# Altium schematic sheet ResetCircuit.SchDoc
size A; SheetNumber: 5; SheetTotal: 8
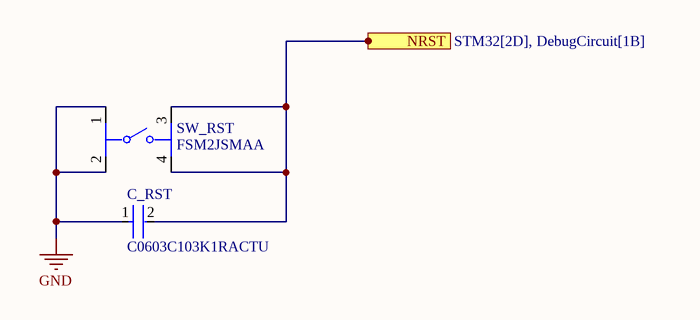
[diagram p0: ResetCircuit.SchDoc]

## Parts
C_RST  C0603C103K1RACTU  [FP-C0603C-CF-MFG]
SW_RST  FSM2JSMAA  [FP-FSM2JSMAA-MFG]

## Ports
NRST (see STM32[2D], DebugCircuit[1B])

## Nets
GND: C_RST.1 SW_RST.1 SW_RST.2
NRST: C_RST.2 SW_RST.3 SW_RST.4 ; port NRST

## Library data of the parts
C_RST = CMP-2006-03036-2: CAP CER 10000PF 100V X7R 0603; Manufacturer: KEMET; Temperature Coefficient: 30ppm/°C; Capacitance: 10,000 pF; Automotive Grade: Grade 1; Value: 10,000 pF; Tolerance: 0.1; ComponentLink2URL: https://api.kemet.com/component-edge/download/datasheet/C0603C100J5GACAUTO.pdf; Height: 0.87mm; ComponentLink2Description: Datasheet; Category: Cap; Mouser Description: Multilayer Ceramic Capacitors MLCC - SMD/SMT 100volts 10000pF X7R 10%; Device Class L3: Ceramic Capacitors; Voltage Rating: 100 V; Temperature Range High: +125°C; Octopart: https://octopart.com/c0603c103k1ractu-kemet-134140; Package: C0603C-CF; Temperature Range Low: -55°C; Device Class L1: Passive Components; Temperature: -55°C to +125°C; RoHS: TRUE; Device Class L2: Capacitors; Lead Free: Yes; Temperature Characteristic: X7R; Manufacturer Part Number: C0603C103K1RACTU; Material: Ceramic; Digikey Description: CAP CER 10000PF 100V X7R 0603; Automotive: Yes
SW_RST = CMP-03402-000003-1: SWITCH TACTILE SPST-NO 0.05A 24V; Manufacturer: TE Connectivity; Standoff Height: 0.05mm; Contact Current Rating: 50mA; Electromechanical Life: 100000Cycles; Operating Force: 260gf; Contact Resistance: 100mΩ; Package: 0; Temperature Range High: +85°C; Temperature: -35°C to +85°C; Category: Switch; Manufacturer Part Number: FSM2JSMAA; RoHS: TRUE; Mouser Description: Tactile Switches TACTILE 260G FORCE S; Device Class L1: Electromechanical; Mount: Surface Mount; Height: 4.59mm; ComponentLink2URL: https://www.te.com/commerce/DocumentDelivery/DDEController?Action=showdoc&DocId=Customer+Drawing%7F2-1437565-7%7FV%7Fpdf%7FEnglish%7FENG_CD_2-1437565-7_V.pdf%7F2-1437565-8; Temperature Range Low: -35°C; Voltage Rating Dc: 24V; Lead Free: Yes; Automotive: No; Throw Configuration: SPST-NO; Octopart: https://octopart.com/fsm2jsmaa-te+connectivity-41720620; Device Class L2: Switches; Device Class L3: Pushbutton Switches; ComponentLink2Description: Datasheet; Digikey Description: SWITCH TACTILE SPST-NO 0.05A 24V